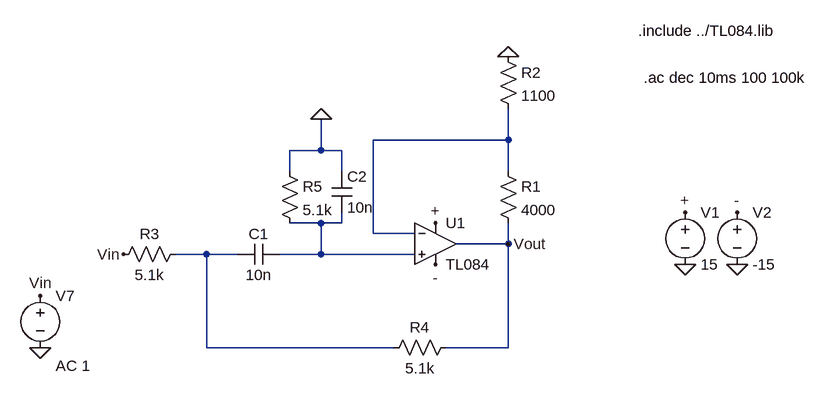
[diagram p0: schematic filtre_passe_bande_sallen_key.asc]
filtre_passe_bande_sallen_key.asc, the LTspice schematic file:
Version 4
SHEET 1 1108 680
WIRE 384 -16 384 -64
WIRE 384 -16 176 -16
WIRE 96 0 96 -48
WIRE 96 0 48 0
WIRE 128 0 96 0
WIRE 48 32 48 0
WIRE 128 32 128 0
WIRE 384 32 384 -16
WIRE 96 112 48 112
WIRE 128 112 128 96
WIRE 128 112 96 112
WIRE 176 128 176 -16
WIRE 240 128 176 128
WIRE 384 144 384 112
WIRE 384 144 304 144
WIRE -80 160 -128 160
WIRE -32 160 -80 160
WIRE 96 160 96 112
WIRE 96 160 32 160
WIRE 240 160 96 160
WIRE -80 304 -80 160
WIRE 208 304 -80 304
WIRE 384 304 384 144
WIRE 384 304 288 304
FLAG 96 -48 0
FLAG 384 -144 0
FLAG -208 160 Vin
FLAG 384 144 Vout
FLAG 656 176 0
FLAG 736 176 0
FLAG 272 112 +
FLAG 656 96 +
FLAG 272 176 -
FLAG 736 96 -
FLAG -336 304 0
FLAG -336 224 Vin
SYMBOL Opamps\\opamp2 272 80 R0
SYMATTR InstName U1
SYMATTR Value TL084
SYMBOL res 368 16 R0
SYMATTR InstName R1
SYMATTR Value 4000
SYMBOL res 368 -160 R0
SYMATTR InstName R2
SYMATTR Value 1100
SYMBOL res -112 144 R90
WINDOW 0 0 56 VBottom 2
WINDOW 3 32 56 VTop 2
SYMATTR InstName R3
SYMATTR Value 5.1k
SYMBOL res 304 288 R90
WINDOW 0 0 56 VBottom 2
WINDOW 3 32 56 VTop 2
SYMATTR InstName R4
SYMATTR Value 5.1k
SYMBOL cap 32 144 R90
WINDOW 0 0 32 VBottom 2
WINDOW 3 32 32 VTop 2
SYMATTR InstName C1
SYMATTR Value 10n
SYMBOL res 32 16 R0
SYMATTR InstName R5
SYMATTR Value 5.1k
SYMBOL cap 112 32 R0
SYMATTR InstName C2
SYMATTR Value 10n
SYMBOL voltage 656 80 R0
WINDOW 123 0 0 Left 0
WINDOW 39 0 0 Left 0
SYMATTR InstName V1
SYMATTR Value 15
SYMBOL voltage 736 80 R0
WINDOW 123 0 0 Left 0
WINDOW 39 0 0 Left 0
SYMATTR InstName V2
SYMATTR Value -15
SYMBOL voltage -336 208 R0
WINDOW 123 24 124 Left 2
WINDOW 39 0 0 Left 0
SYMATTR Value2 AC 1
SYMATTR InstName V7
SYMATTR Value ""
TEXT 584 -184 Left 2 !.include ../TL084.lib
TEXT 592 -112 Left 2 !.ac dec 10ms 100 100k

The netlist it stands for:
* filtre_passe_bande_sallen_key.asc
XU1 N002 N001 + - Vout TL084  ; pins In+ In- V+ V- OUT
R1 N001 Vout 4000
R2 0 N001 1100
R3 N003 Vin 5.1k
R4 Vout N003 5.1k
C1 N002 N003 10n
R5 0 N002 5.1k
C2 0 N002 10n
V1 + 0 15
V2 - 0 -15
V7 Vin 0 AC 1
.include ../TL084.lib
.ac dec 10ms 100 100k
.backanno
.end